# Altium schematic sheet Archimedes_Islemci_Katı.SchDoc: Kontrolcü Katı Tasarımı
size A4; DrawnBy: Emre Rasim; DocumentNumber: 8; Revision: 1.0; SheetNumber: 2; SheetTotal: 8; Sematikicerigi: Kontrolcü Katı Tasarımı
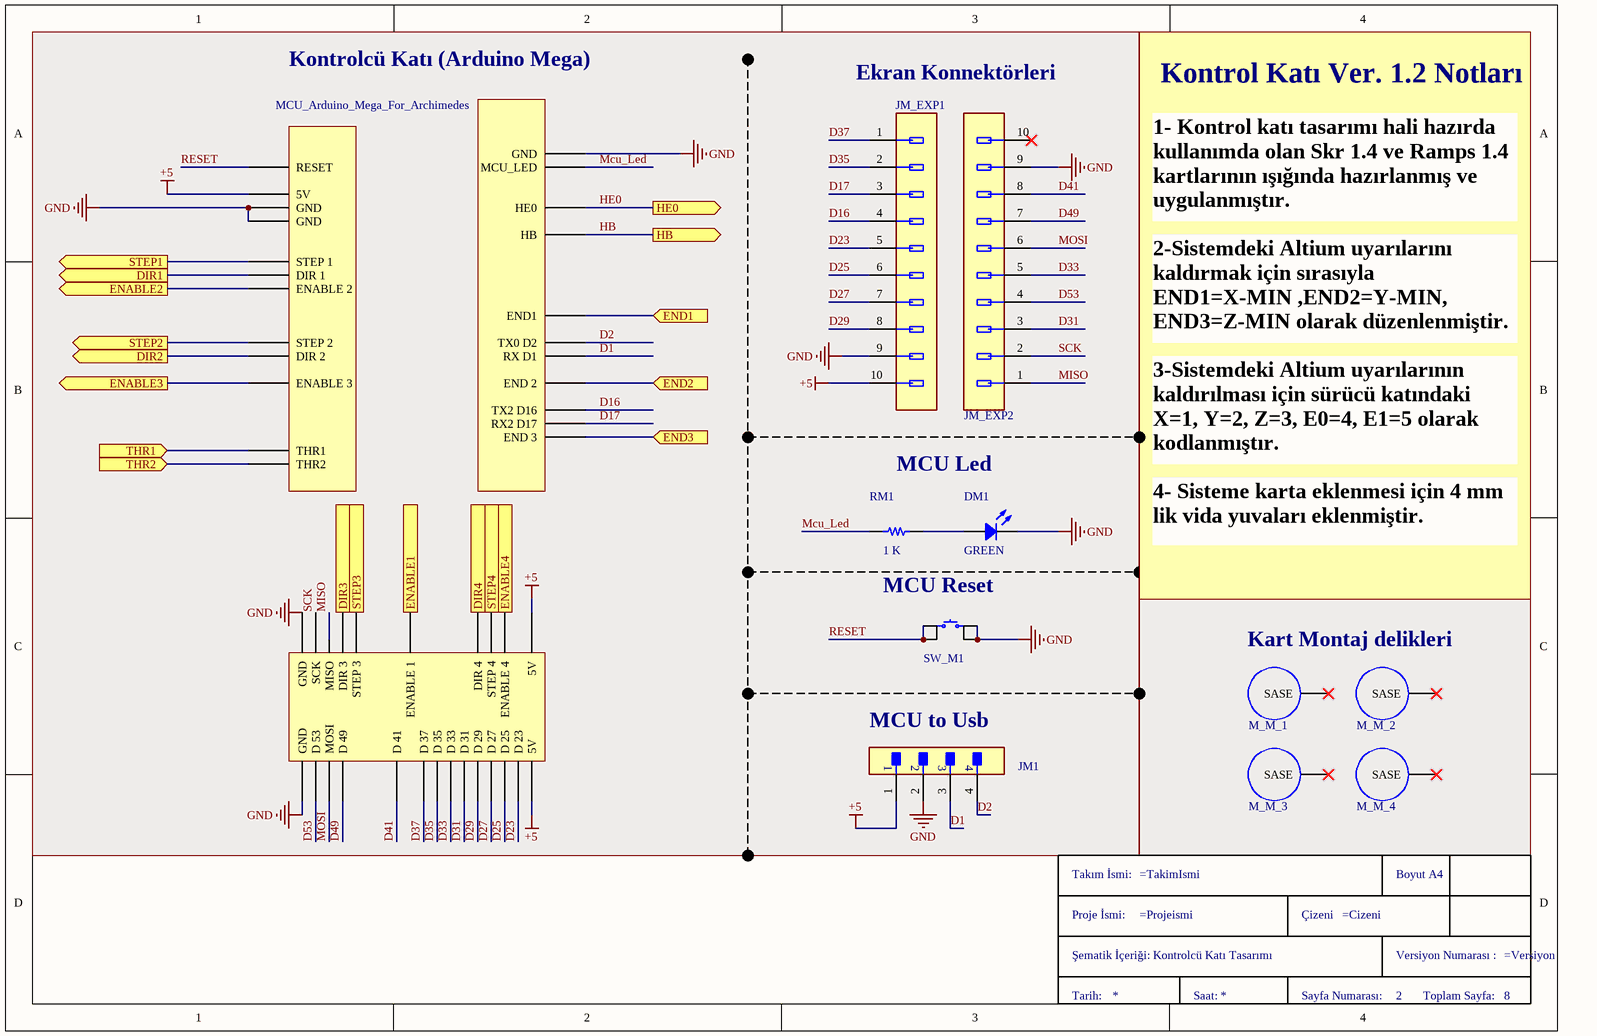
[diagram p0: Archimedes_Islemci_Katı.SchDoc]

## Parts
DM1  GREEN  [LED 0805/2012 GREEN]
JM1  2.5 mm locked  [CON_2.5MM_4_LEAD_180_LOCKED]  (value not drawn)
JM_EXP1  Con_2.54mm_10 lead_2 row_Ipc connector  [Con_10pin_2row_ıpc_connector]  (value not drawn)
JM_EXP2  Con_2.54mm_10 lead_2 row_Ipc connector  [Con_10pin_2row_ıpc_connector]  (value not drawn)
M_M_1  Vida  [Montaj4mm]  (value not drawn)
M_M_2  Vida  [Montaj4mm]  (value not drawn)
M_M_3  Vida  [Montaj4mm]  (value not drawn)
M_M_4  Vida  [Montaj4mm]  (value not drawn)
MCU_Arduino_Mega_For_Archimedes  Arduino Mega 2560  [MCU_Arduino_MEGA for Archimedes]  (value not drawn)
RM1  1 K  [RES 0805/2012]
SW_M1  Push button with 6x6 landmark  [SW_PUSH_6X6mm]  (value not drawn)
TitleBlock-A4  TitleBlock-A4  (value not drawn)  (graphical)

## Blocks framed on the sheet
Kart Montaj delikleri: M_M_1-M_M_4

## Ports
DIR1 (out), DIR2 (out), DIR3 (out), DIR4 (out), ENABLE1 (out), ENABLE2 (out), ENABLE3 (out), ENABLE4 (out), END1 (in), END2 (in), END3 (in), HB (out), HE0 (out), STEP1 (out), STEP2 (out), STEP3 (out), STEP4 (out), THR1 (in), THR2 (in)

## Nets
+5: JM1.1 JM_EXP1.10 MCU_Arduino_Mega_For_Archimedes.1(5V) MCU_Arduino_Mega_For_Archimedes.2(5V) MCU_Arduino_Mega_For_Archimedes.56(5V)
GND: DM1.2 JM1.2 JM_EXP1.9 JM_EXP2.9 MCU_Arduino_Mega_For_Archimedes.35(GND) MCU_Arduino_Mega_For_Archimedes.36(GND) MCU_Arduino_Mega_For_Archimedes.54(GND) MCU_Arduino_Mega_For_Archimedes.55(GND) MCU_Arduino_Mega_For_Archimedes.83(GND) SW_M1.3 SW_M1.4
D1: JM1.3 MCU_Arduino_Mega_For_Archimedes.69(RX_D1)
D2: JM1.4 MCU_Arduino_Mega_For_Archimedes.70(TX0_D2)
D16: JM_EXP1.4 MCU_Arduino_Mega_For_Archimedes.66(TX2_D16)
D17: JM_EXP1.3 MCU_Arduino_Mega_For_Archimedes.65(RX2_D17)
D23: JM_EXP1.5 MCU_Arduino_Mega_For_Archimedes.4(D_23)
D25: JM_EXP1.6 MCU_Arduino_Mega_For_Archimedes.6(D_25)
D27: JM_EXP1.7 MCU_Arduino_Mega_For_Archimedes.8(D_27)
D29: JM_EXP1.8 MCU_Arduino_Mega_For_Archimedes.10(D_29)
D31: JM_EXP2.3 MCU_Arduino_Mega_For_Archimedes.12(D_31)
D33: JM_EXP2.5 MCU_Arduino_Mega_For_Archimedes.14(D_33)
D35: JM_EXP1.2 MCU_Arduino_Mega_For_Archimedes.16(D_35)
D37: JM_EXP1.1 MCU_Arduino_Mega_For_Archimedes.18(D_37)
D41: JM_EXP2.8 MCU_Arduino_Mega_For_Archimedes.22(D_41)
D49: JM_EXP2.7 MCU_Arduino_Mega_For_Archimedes.30(D_49)
D53: JM_EXP2.4 MCU_Arduino_Mega_For_Archimedes.34(D_53)
DIR1: MCU_Arduino_Mega_For_Archimedes.51(DIR_1) ; port DIR1
DIR2: MCU_Arduino_Mega_For_Archimedes.45(DIR_2) ; port DIR2
DIR3: MCU_Arduino_Mega_For_Archimedes.29(DIR_3) ; port DIR3
DIR4: MCU_Arduino_Mega_For_Archimedes.9(DIR_4) ; port DIR4
ENABLE1: MCU_Arduino_Mega_For_Archimedes.19(ENABLE_1) ; port ENABLE1
ENABLE2: MCU_Arduino_Mega_For_Archimedes.50(ENABLE_2) ; port ENABLE2
ENABLE3: MCU_Arduino_Mega_For_Archimedes.44(ENABLE_3) ; port ENABLE3
ENABLE4: MCU_Arduino_Mega_For_Archimedes.5(ENABLE_4) ; port ENABLE4
END1: MCU_Arduino_Mega_For_Archimedes.72(END1) ; port END1
END2: MCU_Arduino_Mega_For_Archimedes.68(END_2) ; port END2
END3: MCU_Arduino_Mega_For_Archimedes.64(END_3) ; port END3
HB: MCU_Arduino_Mega_For_Archimedes.77(HB) ; port HB
HE0: MCU_Arduino_Mega_For_Archimedes.79(HE0) ; port HE0
Mcu_Led: MCU_Arduino_Mega_For_Archimedes.82(MCU_LED) RM1.1
MISO: JM_EXP2.1 MCU_Arduino_Mega_For_Archimedes.31(MISO)
MOSI: JM_EXP2.6 MCU_Arduino_Mega_For_Archimedes.32(MOSI)
RESET: MCU_Arduino_Mega_For_Archimedes.58(RESET) SW_M1.1 SW_M1.2
SCK: JM_EXP2.2 MCU_Arduino_Mega_For_Archimedes.33(SCK)
STEP1: MCU_Arduino_Mega_For_Archimedes.52(STEP_1) ; port STEP1
STEP2: MCU_Arduino_Mega_For_Archimedes.46(STEP_2) ; port STEP2
STEP3: MCU_Arduino_Mega_For_Archimedes.27(STEP_3) ; port STEP3
STEP4: MCU_Arduino_Mega_For_Archimedes.7(STEP_4) ; port STEP4
THR1: MCU_Arduino_Mega_For_Archimedes.39(THR1) ; port THR1
THR2: MCU_Arduino_Mega_For_Archimedes.38(THR2) ; port THR2
NetDM1_1: DM1.1 RM1.2

Not connected (* = marked no-connect by the designer): JM_EXP2 10*; M_M_1 1(SASE)*; M_M_2 1(SASE)*; M_M_3 1(SASE)*; M_M_4 1(SASE)*

## Notes on the sheet
- Kontrolcü Katı (Arduino Mega)
- Ekran Konnektörleri
- Kontrol Katı Ver. 1.2 Notları
- 1- Kontrol katı tasarımı hali hazırda kullanımda olan Skr 1.4 ve Ramps 1.4 kartlarının ışığında hazırlanmış ve uygulanmıştır.
- 2-Sistemdeki Altium uyarılarını kaldırmak için sırasıyla END1=X-MIN ,END2=Y-MIN, END3=Z-MIN olarak düzenlenmiştir.
- MCU Led
- 3-Sistemdeki Altium uyarılarının kaldırılması için sürücü katındaki X=1, Y=2, Z=3, E0=4, E1=5 olarak kodlanmıştır.
- 4- Sisteme karta eklenmesi için 4 mm lik vida yuvaları eklenmiştir.
- MCU Reset
- (near JM1) MCU to Usb
- (in symbol TitleBlock-A4) Takım İsmi:; Boyut A4; Proje İsmi:; Çizeni; Şematik İçeriği:; Versiyon Numarası :; Tarih:; Saat:; Sayfa Numarası:; Toplam Sayfa:

## Library data of the parts
DM1 = LED 805
JM1 = Con_2.5mm_4_lead_180_locked: 2.5 mm 4 lead locked connector
JM_EXP1 JM_EXP2 = Con_2.54mm_10 lead_2 row_Ipc connector: CONN 10 Positions Header Connector 0.100" (2.54mm) Through Hole Gold; Manufacturer: Molex; Part Number: 70246-1001; Voltage: 250V; Current - Maximum per Contact: 2.5A; Number of Circuits: 10; helpURL: https://upverter.com/upn/revision/723849a355ae3f31/; ComponentLink2Description: Datasheet; Temperature: -55°C to +120°C; Package: HDR10; Supplier 2: Mouser; Supplier 1: Digi-Key; ComponentLink1URL: https://upverter.com/upn/revision/723849a355ae3f31/; Supplier Part Number 2: 538-70246-1001; Supplier Part Number 1: WM9219-ND; ComponentLink1Description: Upverter; ComponentLink2URL: http://www.molex.com/pdm_docs/sd/702461001_sd.pdf; RoHS: TRUE; Mouser Part Number: 538-70246-1001; Temperature Range High: +120°C; Digikey Description: CONN 10 Positions Header Connector 0.100" (2.54mm) Through Hole Gold; Digikey Part Number: WM9219-ND; Lead Free: yes; Temperature Range Low: -55°C; Pitch: 2.54mm
M_M_1-M_M_4 = Montaj Deliği 4mm
MCU_Arduino_Mega_For_Archimedes = MCU_Arduino_Mega_For_Archimedes
RM1 = Resistor 805
SW_M1 = SW_PUSH_6X6mm
TitleBlock-A4 = TitleBlock-A4: Title Block for İTU eklemeli imalat takımı